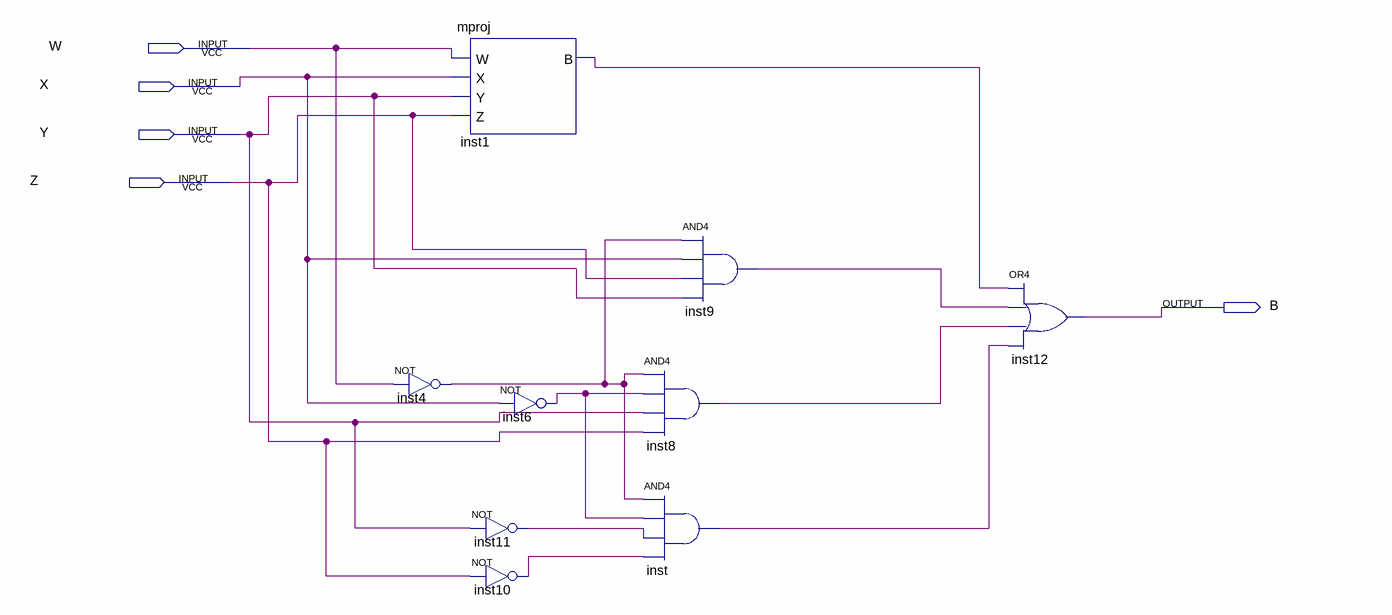
[diagram p0: schematic sheet]
// Quartus schematic Block1.bdf as structural Verilog: 9 symbols, 5 pins
module Block1 (
  input  W,
  input  X,
  input  Y,
  input  Z,
  output B
);

  wire inst1_b, inst4_out, inst6_out, inst8_out, inst9_out, inst10_out, inst11_out, inst_out;

  not inst4 (inst4_out, W);
  mproj inst1 (.W(W), .X(X), .Y(Y), .Z(Z), .B(inst1_b));
  not inst11 (inst11_out, Y);
  not inst10 (inst10_out, Z);
  not inst6 (inst6_out, X);
  and inst9 (inst9_out, inst4_out, X, Z, Y);
  and inst8 (inst8_out, inst4_out, inst6_out, Y, Z);
  and inst (inst_out, inst4_out, inst6_out, inst11_out, inst10_out);
  or inst12 (B, inst1_b, inst9_out, inst8_out, inst_out);
endmodule
